# Altium project haptic_core_v2.PrjPcb (part 1 of 2)
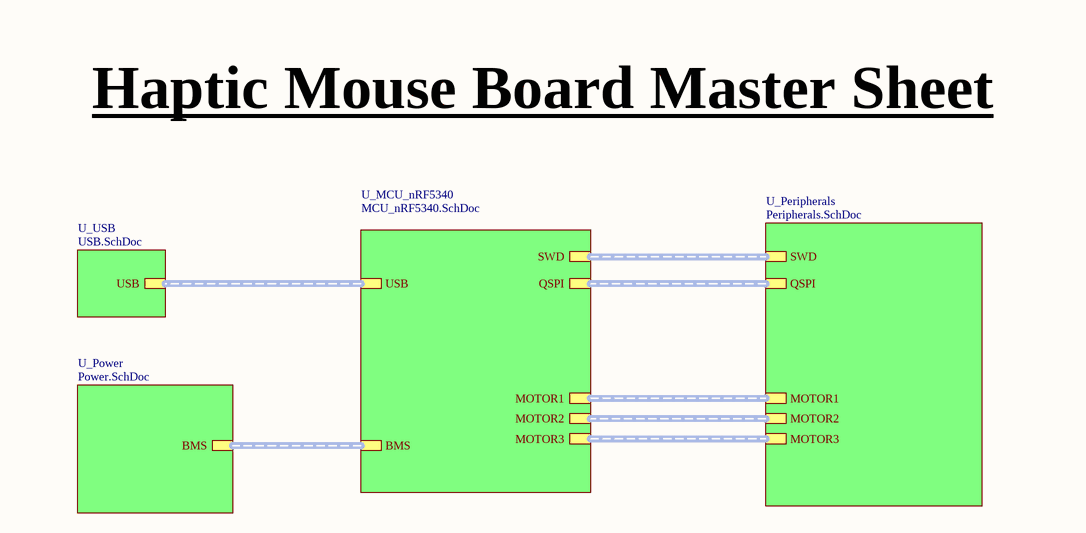
[diagram p0: MASTER.SchDoc]
5 sheets, 68 parts. Net scope: hierarchical (ports join the sheet entries above them; power ports are global).
Board file: board.PcbDoc
Sheets:
  MASTER.SchDoc
    U_Power = Power.SchDoc
    U_USB = USB.SchDoc
    U_Peripherals = Peripherals.SchDoc
    U_MCU_nRF5340 = MCU_nRF5340.SchDoc

## Sheet MASTER.SchDoc: Mouse Development Board Master Sheet
size A4; SheetNumber: 1; SheetTotal: 5; ENG_APP_DATE: --/--/--; DSN_APP_DATE: --/--/--; CHK_APP_DATE: --/--/--

### Sub-sheets
U_MCU_nRF5340 = MCU_nRF5340.SchDoc: SWD (harness STLINK), USB (harness USB), QSPI (harness QSPI), BMS (harness BMS), MOTOR1 (harness MOTOR), MOTOR2 (harness MOTOR), MOTOR3 (harness MOTOR)
U_Peripherals = Peripherals.SchDoc: SWD (harness STLINK), QSPI (harness QSPI), MOTOR1 (harness MOTOR), MOTOR2 (harness MOTOR), MOTOR3 (harness MOTOR)
U_Power = Power.SchDoc: BMS (harness BMS)
U_USB = USB.SchDoc: USB (harness USB)

### Buses and harness runs
harness sheet U_MCU_nRF5340/BMS = sheet U_Power/BMS
harness sheet U_MCU_nRF5340/MOTOR1 = sheet U_Peripherals/MOTOR1
harness sheet U_MCU_nRF5340/MOTOR2 = sheet U_Peripherals/MOTOR2
harness sheet U_MCU_nRF5340/MOTOR3 = sheet U_Peripherals/MOTOR3
harness sheet U_MCU_nRF5340/QSPI = sheet U_Peripherals/QSPI
harness sheet U_MCU_nRF5340/SWD = sheet U_Peripherals/SWD
harness sheet U_MCU_nRF5340/USB = sheet U_USB/USB

### Notes on the sheet
- Haptic Mouse Board Master Sheet
- DWG. NO.
- REV.
- SHT.
- THIS DOCUMENT AND THE DATA DISCLOSED HEREIN OR HEREWITH IS THE PROPERTY OF ALTIUM LIMITED AND MAY BE FREELY DISTRIBUTED IN WHOLE. NO RIGHTS ARE RESERVED OR EXPRESS OR IMPLIED WARANTEE GIVEN.
- REVISION
- DESCRIPTION
- DATE
- APPROVED
- ENG:
- APPROVALS
- PROJECT
- DSN:
- CHK:
- REFERENCE DOCUMENTS
- PROJECT REVISION:
- TITLE
- DOCUMENT REVISION:
- DESIGN ITEM:
- BOM:
- FAB DWG:
- PCB DWG:
- ASSY DWG:
- SCALE:
- SIZE
- B
- CAGE CODE
- FILE NAME
- DWG NO.
- SHEET
- OF
- REV

## Sheet Power.SchDoc: Power Supplies, Battery Charger & Switch
size A2; Revision: 1.0; SheetNumber: 4; SheetTotal: 5; ENG_APP_DATE: --/--/--; DSN_APP_DATE: --/--/--; CHK_APP_DATE: --/--/--
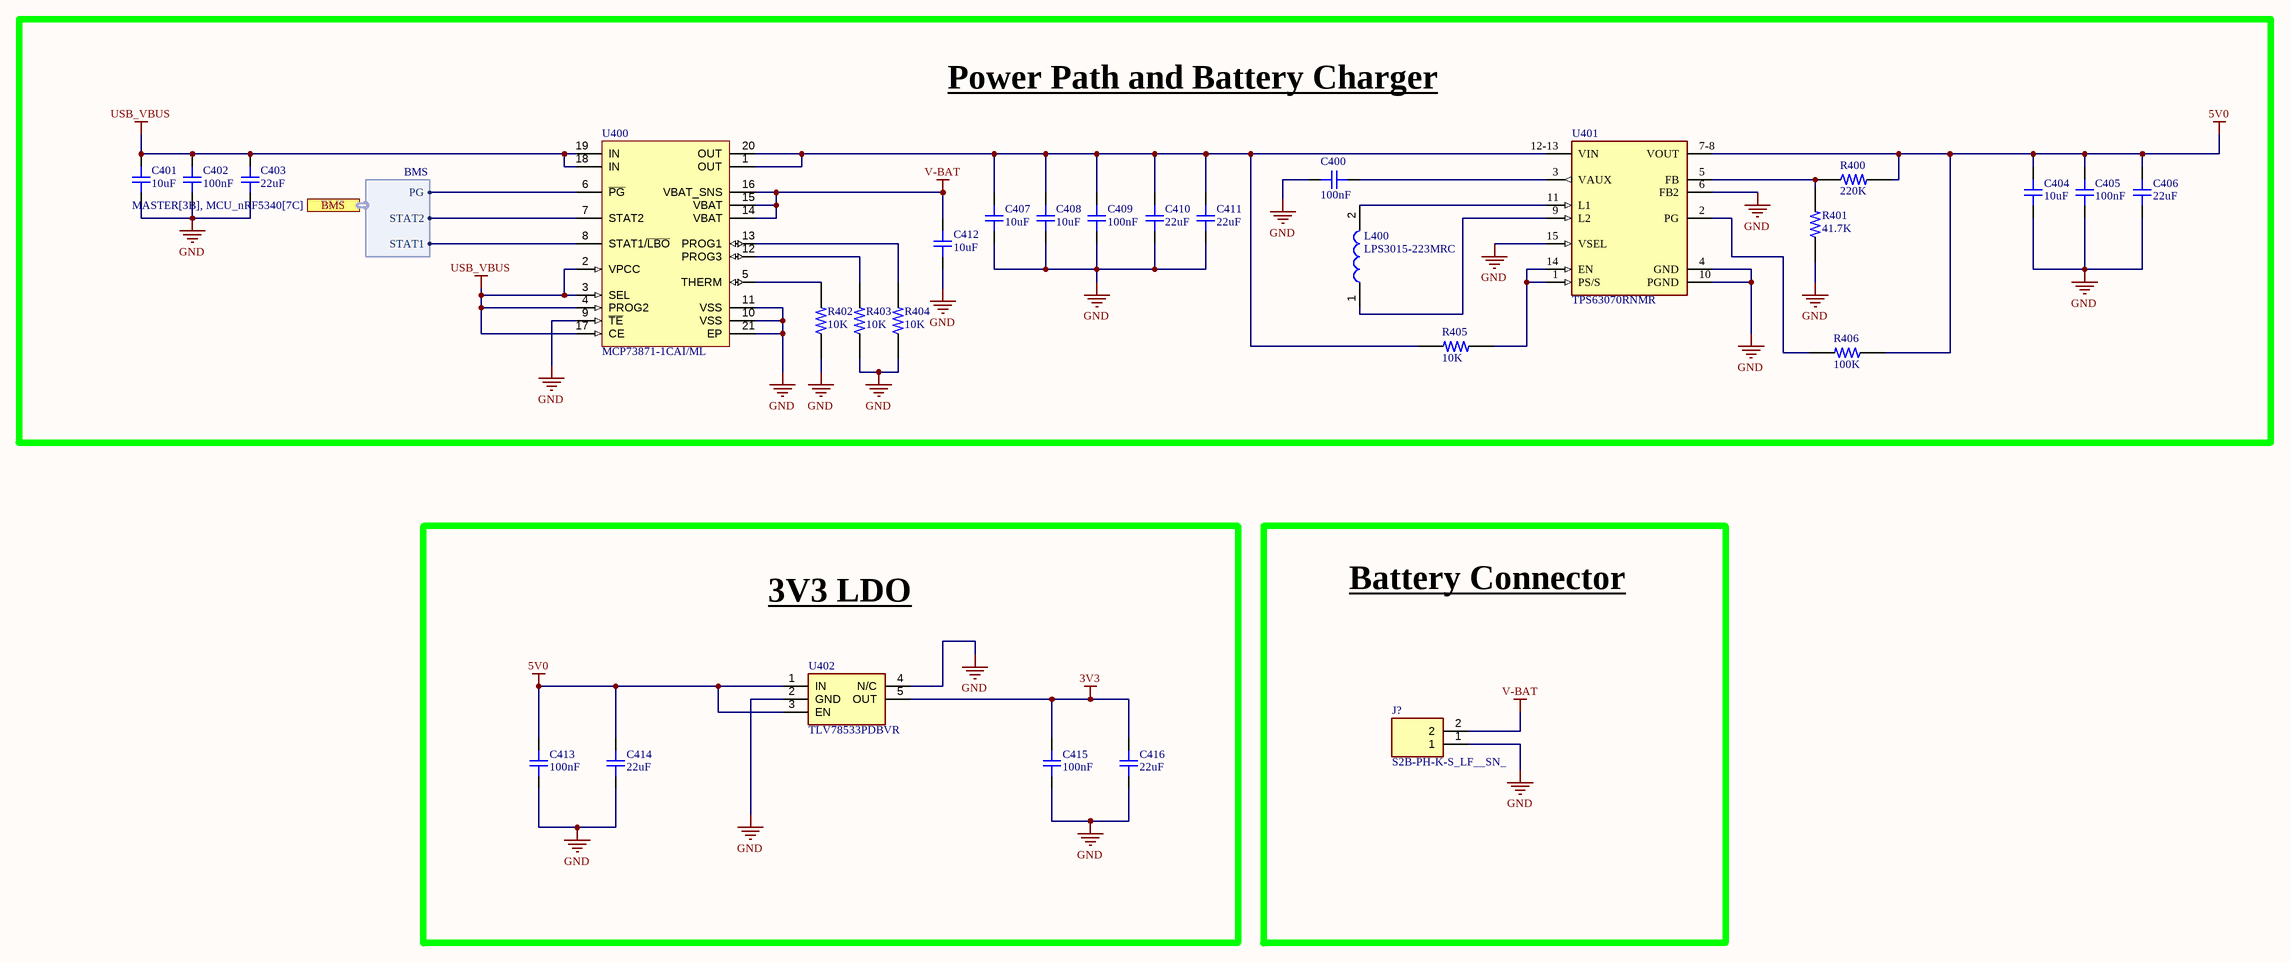
[diagram p1: Power.SchDoc]

### Parts
C400  100nF  [CAP_0603]
C401  10uF  [CAP_0603]
C402  100nF  [CAP_0603]
C403  22uF  [CAP_0603]
C404  10uF  [CAP_0603]
C405  100nF  [CAP_0603]
C406  22uF  [CAP_0603]
C407  10uF  [CAP_0603]
C408  10uF  [CAP_0603]
C409  100nF  [CAP_0603]
C410  22uF  [CAP_0603]
C411  22uF  [CAP_0603]
C412  10uF  [CAP_0603]
C413  100nF  [CAP_0603]
C414  22uF  [CAP_0603]
C415  100nF  [CAP_0603]
C416  22uF  [CAP_0603]
J?  S2B-PH-K-S_LF__SN_  [SHDRRA2W50P0X200_1X2_590X760X480P]
L400  LPS3015-223MRC  [FP-LPS3015-MFG]
R400  220K  [RESC1607X60N]
R401  41.7K  [RESC1607X60N]
R402  10K  [RESC1607X60N]
R403  10K  [RESC1607X60N]
R404  10K  [RESC1607X60N]
R405  10K  [RESC1607X60N]
R406  100K  [RESC1607X60N]
U400  MCP73871-1CAI/ML  [QFN-ML20_M]
U401  TPS63070RNMR  [FP-RNM0015A-MFG]
U402  TLV78533PDBVR  [SOT-23-5]

### Blocks framed on the sheet
Power Path and Battery Charger: C400-C412 L400 R400-R406 U400 U401
3V3 LDO: C413-C416 U402
Battery Connector: J?

### Ports
BMS (harness BMS, see MASTER[3B], MCU_nRF5340[7C])

### Harnesses
BMS: PG, STAT1, STAT2

### Nets
3V3: C415.2 C416.2 U402.5(OUT)  [project net MCU_VDD]
5V0: C404.2 C405.2 C406.2 C413.2 C414.2 R400.2 R406.1 U401.7-8(VOUT) U402.1(IN) U402.3(EN)
GND: C400.2 C401.1 C402.1 C403.1 C404.1 C405.1 C406.1 C407.1 C408.1 C409.1 C410.1 C411.1 C412.1 C413.1 C414.1 C415.1 C416.1 J?.1 R401.1 R402.1 R403.1 R404.1 U400.9(~{TE}) U400.10(VSS) U400.11(VSS) U400.21(EP) U401.4(GND) U401.6(FB2) U401.10(PGND) U401.15(VSEL) U402.2(GND) U402.4(N/C)  [project net MCU_GND]
USB_VBUS: C401.2 C402.2 C403.2 U400.2(VPCC) U400.3(SEL) U400.4(PROG2) U400.17(CE) U400.18(IN) U400.19(IN)  [project net MCU_VBUS]
V-BAT: C412.2 J?.2 U400.14(VBAT) U400.15(VBAT) U400.16(VBAT_SNS)
BMS_PG: U400.6(~{PG}) ; port BMS.PG
BMS_STAT1: U400.8(STAT1/~{LBO}) ; port BMS.STAT1
BMS_STAT2: U400.7(STAT2) ; port BMS.STAT2
NetC400_1: C400.1 U401.3(VAUX)
NetC407_2: C407.2 C408.2 C409.2 C410.2 C411.2 R405.2 U400.1(OUT) U400.20(OUT) U401.12-13(VIN)
NetL400_1: L400.1 U401.9(L2)
NetL400_2: L400.2 U401.11(L1)
NetR400_1: R400.1 R401.2 U401.5(FB)
NetR402_2: R402.2 U400.5(THERM)
NetR403_2: R403.2 U400.12(PROG3)
NetR404_2: R404.2 U400.13(PROG1)
NetR405_1: R405.1 U401.1(PS/S) U401.14(EN)
NetR406_2: R406.2 U401.2(PG)

### Notes on the sheet
- DWG. NO.
- REV.
- SHT.
- THIS DOCUMENT AND THE DATA DISCLOSED HEREIN OR HEREWITH IS THE PROPERTY OF ALTIUM LIMITED AND MAY BE FREELY DISTRIBUTED IN WHOLE. NO RIGHTS ARE RESERVED OR EXPRESS OR IMPLIED WARANTEE GIVEN.
- REVISION
- DESCRIPTION
- DATE
- APPROVED
- ENG:
- APPROVALS
- PROJECT
- DSN:
- CHK:
- REFERENCE DOCUMENTS
- PROJECT REVISION:
- TITLE
- DOCUMENT REVISION:
- DESIGN ITEM:
- BOM:
- FAB DWG:
- PCB DWG:
- ASSY DWG:
- SCALE:
- SIZE
- B
- CAGE CODE
- FILE NAME
- DWG NO.
- SHEET
- OF
- REV

### Library data of the parts
C400 C402 C405 C409 C413 C415 = CAP_0603: Multilayer Ceramic Capacitors MLCC, 0.1 uF, 10 %, 0603, 50V, X7R, TR; Manufacturer: *; Manufacturer Part Number: *; Distributor Link: *; LCSC: *; Rating: *; Dielectric: *; Supplier: Future Electronics; Supplier Part Number: 2183445; RoHS: Compliant; Category: Ceramic Capacitors; Stock: 3000; Pricing: 3000=0.0115, 9000=0.0112, 30000=0.0109, 60000=0.0108, 120000=0.0105 (USD); Value: 100nF; Dielectric Material: Ceramic; Lifecycle Status: Production; Max Operating Temperature: 125°C; Min Operating Temperature: -55°C; Mounting Technology: Surface Mount; Number of Terminals: 2; REACH SVHC: Yes; Voltage Rating (DC): 50V; ComponentLink1URL: https://datasheet.octopart.com:443/MAJCU168BB7104KTEA01-Taiyo-Yuden-datasheet-182113548.pdf?src-supplier=IHS; ComponentLink1Description: https://datasheet.octopart.com:443/MAJCU168BB7104KTEA01-Taiyo-Yuden-datasheet-182113548.pdf?src-supplier=IHS
C401 C404 C407 C408 C412 = CAP_0603: Ceramic Capacitor, Multilayer, Ceramic, 4V, 20% +Tol, 20% -Tol, X6S, 22% TC, 10uF, Surface Mount, 1608M/0603; Value: 10µF; Manufacturer: *; Manufacturer Part Number: *; Distributor Link: *; LCSC: *; Rating: *; Dielectric: *; Supplier: Mouser; Supplier Part Number: 81-GXT188C80G106ME3D; RoHS: Compliant; Category: Ceramic Capacitors; Stock: 3027; Pricing: 1=0.31, 10=0.202, 50=0.202, 100=0.115, 1000=0.082, 10000=0.063 (USD); Case/Package: 0603; Dielectric Material: Ceramic; Height: 800µm; Length: 1.6mm; Lifecycle Status: Production; Material: Ceramic; Max Operating Temperature: 105°C; Min Operating Temperature: -55°C; Mounting Technology: Surface Mount; Number of Terminals: 2; REACH SVHC: Yes; Tolerance: 20%; Voltage Rating: 4V; Voltage Rating (DC): 4V; Width: 800µm; ComponentLink1URL: http://sigma.octopart.com:80/reach_statement/Murata-company-16.pdf?src-supplier=Compliance+Statements; ComponentLink1Description: http://sigma.octopart.com:80/reach_statement/Murata-company-16.pdf?src-supplier=Compliance+Statements
C403 C406 C410 C411 C414 C416 = CAP_0603: Ceramic Capacitor, Multilayer, Ceramic, 6.3V, 20% +Tol, 20% -Tol, X6S, 22uF, Surface Mount, 1608M/0603; Value: 22µF; Manufacturer: *; Manufacturer Part Number: *; Distributor Link: *; LCSC: *; Rating: *; Dielectric: *; Supplier: Mouser; Supplier Part Number: 81-GRM188C80J226ME1D; RoHS: Compliant; Category: Ceramic Capacitors; Stock: 5675; Pricing: 1=0.3, 1=0.258, 10=0.195, 10=0.168, 50=0.195, 100=0.112, 100=0.096, 500=0.077, 1000=0.082, 1000=0.071, 2000=0.065, 4000=0.057, 8000=0.053, 10000=0.062, 24000=0.052 (USD); Case/Package: 0603; Dielectric Material: Ceramic; Height: 800µm; Length: 1.6mm; Lifecycle Status: Production; Material: Ceramic; Max Operating Temperature: 105°C; Min Operating Temperature: -55°C; Mounting Technology: Surface Mount; Number of Terminals: 2; REACH SVHC: Yes; Thickness: 800µm; Tolerance: 20%; Voltage Rating: 6.3V; Voltage Rating (DC): 6.3V; Width: 800µm; ComponentLink1URL: https://datasheet.octopart.com:443/GRM188C80J226ME01D-Murata-datasheet-165579666.pdf?src-supplier=TME; ComponentLink1Description: https://datasheet.octopart.com:443/GRM188C80J226ME01D-Murata-datasheet-165579666.pdf?src-supplier=TME; ComponentLink2URL: https://datasheet.octopart.com/GRM188C80J226ME01D-Murata-datasheet-12515295.pdf; ComponentLink2Description: https://datasheet.octopart.com/GRM188C80J226ME01D-Murata-datasheet-12515295.pdf; ComponentLink3URL: https://datasheet.octopart.com/GRM188C80J226ME01D-Murata-datasheet-12510076.pdf; ComponentLink3Description: https://datasheet.octopart.com/GRM188C80J226ME01D-Murata-datasheet-12510076.pdf; ComponentLink4URL: https://datasheet.octopart.com/GRM188C80J226ME01D-Murata-datasheet-11978611.pdf; ComponentLink4Description: https://datasheet.octopart.com/GRM188C80J226ME01D-Murata-datasheet-11978611.pdf; ComponentLink5URL: https://datasheet.octopart.com/GRM188C80J226ME01D-Murata-datasheet-10025737.pdf; ComponentLink5Description: https://datasheet.octopart.com/GRM188C80J226ME01D-Murata-datasheet-10025737.pdf; ComponentLink6URL: https://datasheet.octopart.com/GRM188C80J226ME01D-Murata-datasheet-8819587.pdf; ComponentLink6Description: https://datasheet.octopart.com/GRM188C80J226ME01D-Murata-datasheet-8819587.pdf; ComponentLink7URL: http://sigma.octopart.com:80/reach_statement/Murata-company-16.pdf?src-supplier=Compliance+Statements; ComponentLink7Description: http://sigma.octopart.com:80/reach_statement/Murata-company-16.pdf?src-supplier=Compliance+Statements
J? = S2B-PH-K-S_LF__SN_: PH-2.0mm Header side entry 2 way JST PH Series, Series Number S2B, 2mm Pitch 2 Way 1 Row Right Angle PCB Header, Through Hole Termination, 2A; Manufacturer_Name: JST (JAPAN SOLDERLESS TERMINALS); Manufacturer_Part_Number: S2B-PH-K-S(LF)(SN); Geometry.Height: 4.8mm; Mouser Part Number: 306-S2BPHKSLFSNPP; Mouser Price/Stock: https://www.mouser.co.uk/ProductDetail/JST-Commercial/S2B-PH-K-SLFSN?qs=cdbOS8ANM9A5Ie4gXeMjTA%3D%3D; Datasheet Link: *
L400 = LPS3015-223MRC: Inductor; Manufacturer_Name: COILCRAFT; Datasheet Link: https://www.digikey.com/en/products/detail/coilcraft/LPS3015-223MRC/12714657; Height: 1.5mm; Manufacturer_Part_Number: LPS3015-223MRC; Mouser Part Number: 994-LPS3015-223MRC; Mouser Price/Stock: https://www.mouser.co.uk/ProductDetail/Coilcraft/LPS3015-223MRC?qs=QQJxVsr8EGYLL9xIR9QoZA%3D%3D
R400 = RC0603JR0710KL: Res Thick Film 0603 220K Ohm 1% 1/10W ±100ppm/°C Molded SMD SMD Paper Tape on Plastic Reel; Manufacturer: Bourns; Manufacturer Part Number: CR0603-FX-2203ELF; MF: Yageo; Max Power Dissipation: 100mW; Voltage Rating: 75V; Voltage Rating (DC): 50V; SnapEDA_Link: https://www.snapeda.com/parts/RC0603JR0710KL/Yageo/view-part/?ref=snap; Package: 0603 Yageo; Value: *; MP: RC0603JR0710KL; Check_prices: https://www.snapeda.com/parts/RC0603JR0710KL/Yageo/view-part/?ref=eda; Supplier: RS; Supplier Part Number: 458582; RoHS: Compliant; Category: Chip SMD Resistors; Stock: 14800; Pricing: 10=0.004 (EUR); Case/Package: 0603; Case Code (Imperial): 0603; Case Code (Metric): 1608; China RoHS: Non-Compliant; Composition: Thick Film; Contact Plating: Tin; Features: Moisture Resistant; Height: 450µm; Length: 1.6002mm; Lifecycle Status: Production; Max Operating Temperature: 155°C; Min Operating Temperature: -55°C; Mounting Technology: Surface Mount; Number of Terminals: 2; Number of Terminations: 2; Power Dissipation: 100mW; Power Rating: 100mW; Radiation Hardening: No; REACH SVHC: Yes; Schedule B: 8533210045, 8533210045|8533210045, 8533210045|8533210045|8533210045, 8533210045|8533210045|8533210045|8533210045; Temperature Coefficient: 100ppm/°C; Termination: SMD/SMT; Tolerance: 1%; Width: 800µm; Working Voltage: 75V; ComponentLink1URL: https://datasheet.octopart.com:443/CR0603-FX-2203ELF-Bourns-datasheet-159578630.pdf?src-supplier=ODG+(Origin+Data+Global); ComponentLink1Description: https://datasheet.octopart.com:443/CR0603-FX-2203ELF-Bourns-datasheet-159578630.pdf?src-supplier=ODG+(Origin+Data+Global); ComponentLink2URL: https://datasheet.octopart.com:443/CR0603-FX-2203ELF-Bourns-datasheet-181955239.pdf?src-supplier=IHS; ComponentLink2Description: https://datasheet.octopart.com:443/CR0603-FX-2203ELF-Bourns-datasheet-181955239.pdf?src-supplier=IHS; ComponentLink3URL: https://datasheet.octopart.com:443/CR0603-FX-2203ELF-Bourns-datasheet-68301634.pdf?src-supplier=Burklin+Elektronik; ComponentLink3Description: https://datasheet.octopart.com:443/CR0603-FX-2203ELF-Bourns-datasheet-68301634.pdf?src-supplier=Burklin+Elektronik; ComponentLink4URL: https://datasheet.octopart.com:443/CR0603-FX-2203ELF-Bourns-datasheet-49799764.pdf?src-supplier=Newark; ComponentLink4Description: https://datasheet.octopart.com:443/CR0603-FX-2203ELF-Bourns-datasheet-49799764.pdf?src-supplier=Newark; ComponentLink5URL: https://datasheet.octopart.com:443/CR0603-FX-2203ELF-Bourns-datasheet-154729663.pdf?src-supplier=Electro+Sonic; ComponentLink5Description: https://datasheet.octopart.com:443/CR0603-FX-2203ELF-Bourns-datasheet-154729663.pdf?src-supplier=Electro+Sonic; ComponentLink6URL: https://datasheet.octopart.com/CR0603-FX-2203ELF-Bourns-datasheet-5318152.pdf; ComponentLink6Description: https://datasheet.octopart.com/CR0603-FX-2203ELF-Bourns-datasheet-5318152.pdf; ComponentLink7URL: https://datasheet.octopart.com:443/CR0603-FX-2203ELF-Bourns-datasheet-137066215.pdf?src-supplier=X-ON; ComponentLink7Description: https://datasheet.octopart.com:443/CR0603-FX-2203ELF-Bourns-datasheet-137066215.pdf?src-supplier=X-ON; ComponentLink8URL: https://datasheet.octopart.com:443/CR0603-FX-2203ELF-Bourns-datasheet-140567134.pdf?src-supplier=Arrow.cn; ComponentLink8Description: https://datasheet.octopart.com:443/CR0603-FX-2203ELF-Bourns-datasheet-140567134.pdf?src-supplier=Arrow.cn; ComponentLink9URL: http://sigma.octopart.com:80/conflict_mineral_statement/Bourns-company-36.pdf?src-supplier=Compliance+Statements; ComponentLink9Description: http://sigma.octopart.com:80/conflict_mineral_statement/Bourns-company-36.pdf?src-supplier=Compliance+Statements
R401 = RC0603JR0710KL: Res Thin Film 0402 41.7K Ohm 0.1% 1/16W 25ppm/C Molded SMD SMD Paper T/R; Manufacturer: Vishay; Manufacturer Part Number: TNPW040241K7BEED; MF: Yageo; Max Power Dissipation: 63mW; Temperature Coefficient: 25ppm/°C; Working Voltage: 50V; SnapEDA_Link: https://www.snapeda.com/parts/RC0603JR0710KL/Yageo/view-part/?ref=snap; Package: 0603 Yageo; Value: *; MP: RC0603JR0710KL; Check_prices: https://www.snapeda.com/parts/RC0603JR0710KL/Yageo/view-part/?ref=eda; Supplier: Farnell; Supplier Part Number: 3975618RL; RoHS: Compliant; Category: Chip SMD Resistors; Stock: 4910; Pricing: 100=0.15, 500=0.128, 2500=0.127, 5000=0.118, 10000=0.0988 (EUR); Case/Package: 0402; China RoHS: Compliant; Composition: Thin Film; Contact Plating: Tin; Features: Anti-Sulfur, Automotive AEC-Q200, Moisture Resistant; Height: 350µm; Length: 990.6µm; Lifecycle Status: Production; Max Operating Temperature: 125°C; Min Operating Temperature: -55°C; Mounting Technology: Surface Mount; Number of Terminals: 2; Number of Terminations: 2; Power Dissipation: 63mW; Power Rating: 63mW; REACH SVHC: Yes; Tolerance: 0.1%; Width: 500µm; ComponentLink1URL: https://datasheet.octopart.com:443/TNPW040241K7BEED-Vishay-datasheet-182188515.pdf?src-supplier=IHS; ComponentLink1Description: https://datasheet.octopart.com:443/TNPW040241K7BEED-Vishay-datasheet-182188515.pdf?src-supplier=IHS; ComponentLink2URL: https://datasheet.octopart.com:443/TNPW040241K7BEED-Vishay-Dale-datasheet-182026744.pdf?src-supplier=IHS; ComponentLink2Description: https://datasheet.octopart.com:443/TNPW040241K7BEED-Vishay-Dale-datasheet-182026744.pdf?src-supplier=IHS; ComponentLink3URL: https://datasheet.octopart.com/TNPW040241K7BEED-Vishay-datasheet-13498837.pdf; ComponentLink3Description: https://datasheet.octopart.com/TNPW040241K7BEED-Vishay-datasheet-13498837.pdf; ComponentLink4URL: https://datasheet.octopart.com/TNPW040241K7BEED-Vishay-datasheet-13414878.pdf; ComponentLink4Description: https://datasheet.octopart.com/TNPW040241K7BEED-Vishay-datasheet-13414878.pdf; ComponentLink5URL: https://datasheet.octopart.com/TNPW040241K7BEED-Vishay-datasheet-13295955.pdf; ComponentLink5Description: https://datasheet.octopart.com/TNPW040241K7BEED-Vishay-datasheet-13295955.pdf; ComponentLink6URL: https://datasheet.octopart.com/TNPW040241K7BEED-Vishay-datasheet-13196373.pdf; ComponentLink6Description: https://datasheet.octopart.com/TNPW040241K7BEED-Vishay-datasheet-13196373.pdf; ComponentLink7URL: https://datasheet.octopart.com/TNPW040241K7BEED-Vishay-datasheet-13143890.pdf; ComponentLink7Description: https://datasheet.octopart.com/TNPW040241K7BEED-Vishay-datasheet-13143890.pdf; ComponentLink8URL: https://datasheet.octopart.com/TNPW040241K7BEED-Vishay-datasheet-13081780.pdf; ComponentLink8Description: https://datasheet.octopart.com/TNPW040241K7BEED-Vishay-datasheet-13081780.pdf; ComponentLink9URL: https://datasheet.octopart.com/TNPW040241K7BEED-Vishay-datasheet-13052401.pdf; ComponentLink9Description: https://datasheet.octopart.com/TNPW040241K7BEED-Vishay-datasheet-13052401.pdf; ComponentLink10URL: https://datasheet.octopart.com/TNPW040241K7BEED-Vishay-datasheet-13034137.pdf; ComponentLink10Description: https://datasheet.octopart.com/TNPW040241K7BEED-Vishay-datasheet-13034137.pdf; ComponentLink11URL: https://datasheet.octopart.com/TNPW040241K7BEED-Vishay-datasheet-12585086.pdf; ComponentLink11Description: https://datasheet.octopart.com/TNPW040241K7BEED-Vishay-datasheet-12585086.pdf; ComponentLink12URL: https://datasheet.octopart.com/TNPW040241K7BEED-Vishay-datasheet-12543131.pdf; ComponentLink12Description: https://datasheet.octopart.com/TNPW040241K7BEED-Vishay-datasheet-12543131.pdf; ComponentLink13URL: https://datasheet.octopart.com/TNPW040241K7BEED-Vishay-datasheet-12532511.pdf; ComponentLink13Description: https://datasheet.octopart.com/TNPW040241K7BEED-Vishay-datasheet-12532511.pdf; ComponentLink14URL: https://datasheet.octopart.com/TNPW040241K7BEED-Vishay-datasheet-12519971.pdf; ComponentLink14Description: https://datasheet.octopart.com/TNPW040241K7BEED-Vishay-datasheet-12519971.pdf; ComponentLink15URL: https://datasheet.octopart.com/TNPW040241K7BEED-Vishay-datasheet-12509767.pdf; ComponentLink15Description: https://datasheet.octopart.com/TNPW040241K7BEED-Vishay-datasheet-12509767.pdf; ComponentLink16URL: https://datasheet.octopart.com/TNPW040241K7BEED-Vishay-datasheet-12365287.pdf; ComponentLink16Description: https://datasheet.octopart.com/TNPW040241K7BEED-Vishay-datasheet-12365287.pdf; ComponentLink17URL: https://datasheet.octopart.com/TNPW040241K7BEED-Vishay-datasheet-10854096.pdf; ComponentLink17Description: https://datasheet.octopart.com/TNPW040241K7BEED-Vishay-datasheet-10854096.pdf; ComponentLink18URL: https://datasheet.octopart.com/TNPW040241K7BEED-Vishay-datasheet-10678752.pdf; ComponentLink18Description: https://datasheet.octopart.com/TNPW040241K7BEED-Vishay-datasheet-10678752.pdf; ComponentLink19URL: https://datasheet.octopart.com/TNPW040241K7BEED-Vishay-datasheet-10283461.pdf; ComponentLink19Description: https://datasheet.octopart.com/TNPW040241K7BEED-Vishay-datasheet-10283461.pdf; ComponentLink20URL: https://datasheet.octopart.com/TNPW040241K7BEED-Vishay-datasheet-10185418.pdf; ComponentLink20Description: https://datasheet.octopart.com/TNPW040241K7BEED-Vishay-datasheet-10185418.pdf; ComponentLink21URL: https://datasheet.octopart.com/TNPW040241K7BEED-Vishay-datasheet-10055244.pdf; ComponentLink21Description: https://datasheet.octopart.com/TNPW040241K7BEED-Vishay-datasheet-10055244.pdf; ComponentLink22URL: http://sigma.octopart.com:80/rohs_statement/Vishay-company-15.pdf?src-supplier=Compliance+Statements; ComponentLink22Description: http://sigma.octopart.com:80/rohs_statement/Vishay-company-15.pdf?src-supplier=Compliance+Statements
R402-R405 = RC0603JR0710KL: 10 kOhms ±5% 0.1W Chip Resistor 0603 Anti-Sulfur AEC-Q200 Thick Film; Manufacturer: Vishay; Manufacturer Part Number: RCA060310K0JNEA; MF: Yageo; Max Power Dissipation: 100mW; Temperature Coefficient: 200ppm/°C; Working Voltage: 75V; SnapEDA_Link: https://www.snapeda.com/parts/RC0603JR0710KL/Yageo/view-part/?ref=snap; Package: 0603 Yageo; Value: *; MP: RC0603JR0710KL; Check_prices: https://www.snapeda.com/parts/RC0603JR0710KL/Yageo/view-part/?ref=eda; Supplier: Arrow Electronics; Supplier Part Number: RCA060310K0JNEA; RoHS: Compliant; Category: Chip SMD Resistors; Stock: 2572; Pricing: 1=0.018, 10=0.005, 25=0.005, 100=0.004, 250=0.004, 500=0.004, 1000=0.004 (USD); Case/Package: 0603; Case Code (Imperial): 0603; Case Code (Metric): 1608; China RoHS: Non-Compliant; Composition: Thick Film; Contact Plating: Tin; Features: Anti-Sulfur, Automotive AEC-Q200; Height: 450µm; Length: 1.5494mm; Lifecycle Status: Production; Max Operating Temperature: 155°C; Min Operating Temperature: -55°C; Mounting Technology: Surface Mount; Number of Terminals: 2; Number of Terminations: 2; Power Dissipation: 100mW; Radiation Hardening: No; REACH SVHC: Yes; Schedule B: 8533210045, 8533210045|8533210045|8533210045|8533210045|8533210045; Tolerance: 5%; Width: 850µm; ComponentLink1URL: https://datasheet.octopart.com:443/RCA060310K0JNEA-Vishay-datasheet-181963188.pdf?src-supplier=IHS; ComponentLink1Description: https://datasheet.octopart.com:443/RCA060310K0JNEA-Vishay-datasheet-181963188.pdf?src-supplier=IHS; ComponentLink2URL: https://datasheet.octopart.com:443/RCA060310K0JNEA-Vishay-datasheet-188933149.pdf?src-supplier=TME; ComponentLink2Description: https://datasheet.octopart.com:443/RCA060310K0JNEA-Vishay-datasheet-188933149.pdf?src-supplier=TME; ComponentLink3URL: https://datasheet.octopart.com:443/RCA060310K0JNEA-Vishay-datasheet-12588632.pdf?src-supplier=Future+Electronics; ComponentLink3Description: https://datasheet.octopart.com:443/RCA060310K0JNEA-Vishay-datasheet-12588632.pdf?src-supplier=Future+Electronics; ComponentLink4URL: https://datasheet.octopart.com:443/RCA060310K0JNEA-Vishay-datasheet-12542284.pdf?src-supplier=Future+Electronics; ComponentLink4Description: https://datasheet.octopart.com:443/RCA060310K0JNEA-Vishay-datasheet-12542284.pdf?src-supplier=Future+Electronics; ComponentLink5URL: https://datasheet.octopart.com:443/RCA060310K0JNEA-Vishay-datasheet-12535775.pdf?src-supplier=Future+Electronics; ComponentLink5Description: https://datasheet.octopart.com:443/RCA060310K0JNEA-Vishay-datasheet-12535775.pdf?src-supplier=Future+Electronics; ComponentLink6URL: https://datasheet.octopart.com:443/RCA060310K0JNEA-Vishay-datasheet-12509930.pdf?src-supplier=Future+Electronics; ComponentLink6Description: https://datasheet.octopart.com:443/RCA060310K0JNEA-Vishay-datasheet-12509930.pdf?src-supplier=Future+Electronics; ComponentLink7URL: https://datasheet.octopart.com:443/RCA060310K0JNEA-Vishay-datasheet-5392162.pdf?src-supplier=Future+Electronics; ComponentLink7Description: https://datasheet.octopart.com:443/RCA060310K0JNEA-Vishay-datasheet-5392162.pdf?src-supplier=Future+Electronics; ComponentLink8URL: http://sigma.octopart.com:80/rohs_statement/Vishay-company-15.pdf?src-supplier=Compliance+Statements; ComponentLink8Description: http://sigma.octopart.com:80/rohs_statement/Vishay-company-15.pdf?src-supplier=Compliance+Statements
R406 = RC0603JR0710KL: Resistor Chip Thick Film 100k Ohm 1% 1/10W ±100ppm/°K Molded T/R; Manufacturer: Vishay; Manufacturer Part Number: CRCW0603100KFKED; MF: Yageo; Power Dissipation: 100mW; Temperature Coefficient: 100ppm/°C; Working Voltage: 75V; SnapEDA_Link: https://www.snapeda.com/parts/RC0603JR0710KL/Yageo/view-part/?ref=snap; Package: 0603 Yageo; Value: *; MP: RC0603JR0710KL; Check_prices: https://www.snapeda.com/parts/RC0603JR0710KL/Yageo/view-part/?ref=eda; Supplier: Mouser; Supplier Part Number: 71-CRCW0603100KFKED; RoHS: Compliant; Category: Chip SMD Resistors; Stock: 39690; Pricing: 1=0.12, 10=0.033, 50=0.033, 100=0.016, 1000=0.010, 10000=0.005 (USD); Case/Package: 0603; China RoHS: Non-Compliant; Height: 450µm; Lead Free: Lead Free; Lifecycle Status: Production; Max Operating Temperature: 155°C; Min Operating Temperature: -55°C; Mounting Technology: Surface Mount; Number of Terminals: 2; Power Rating: 100mW; REACH SVHC: Yes; Tolerance: 1%; Width: 850µm; ComponentLink1URL: https://datasheet.octopart.com:443/CRCW0603100KFKED-Vishay-datasheet-175423584.pdf?src-supplier=IHS; ComponentLink1Description: https://datasheet.octopart.com:443/CRCW0603100KFKED-Vishay-datasheet-175423584.pdf?src-supplier=IHS; ComponentLink2URL: http://sigma.octopart.com:80/rohs_statement/Vishay-company-15.pdf?src-supplier=Compliance+Statements; ComponentLink2Description: http://sigma.octopart.com:80/rohs_statement/Vishay-company-15.pdf?src-supplier=Compliance+Statements
U400 = MCP73871-1CAI/ML: EAR99 MCP73871 Matte Tin (Sn) Tube battery charger 5.35V 1.1A 0.5mm -40C~85C TA; Manufacturer: Microchip; Output Voltage: 4.1V; DatasheetVersion: revB, May-2009; PackageReference: QFN-ML20; PackageDescription: 20-Lead Plastic Quad Flat, No Lead Package (ML) - 4x4x0.9 mm Body [QFN]; PackageVersion: revBB, Aug-2009; Supplier: DigiKey; Supplier Part Number: MCP73871-1CAI/ML-ND; Manufacturer Part Number: MCP73871-1CAI/ML; Category: Battery Management; Stock: 47; Pricing: 1=2.08, 25=1.736 (EUR); Projected EOL Date: 2034-07-17; Case/Package: QFN; Country of Assembly: Malaysia, Thailand; Country of Fabrication: United States of America; Country of Origin: Malaysia, Thailand; Export Control Classification Number (ECCN) Code: EAR99; Harmonized Tariff Schedule (HTS) Code: 8542.39.0060; Introduction Date: 2008-07-17; Lifecycle Status: Production; Pins: 20; RoHS: Non-Compliant; ComponentLink1URL: https://datasheet.octopart.com/MCP73871-1CAI/ML-Microchip-datasheet-11053087.pdf; ComponentLink1Description: https://datasheet.octopart.com/MCP73871-1CAI/ML-Microchip-datasheet-11053087.pdf; ComponentLink2URL: https://datasheet.octopart.com:443/MCP73871-1CAI-ML-Microchip-datasheet-175858736.pdf?src-supplier=Microchip; ComponentLink2Description: https://datasheet.octopart.com:443/MCP73871-1CAI-ML-Microchip-datasheet-175858736.pdf?src-supplier=Microchip; ComponentLink3URL: https://datasheet.octopart.com:443/MCP73871-1CAI-ML-Microchip-datasheet-137252038.pdf?src-supplier=Electro+Sonic; ComponentLink3Description: https://datasheet.octopart.com:443/MCP73871-1CAI-ML-Microchip-datasheet-137252038.pdf?src-supplier=Electro+Sonic; ComponentLink4URL: https://datasheet.octopart.com:443/MCP73871-1CAI-ML-Microchip-datasheet-159005942.pdf?src-supplier=SHENGYU+ELECTRONICS; ComponentLink4Description: https://datasheet.octopart.com:443/MCP73871-1CAI-ML-Microchip-datasheet-159005942.pdf?src-supplier=SHENGYU+ELECTRONICS; ComponentLink5URL: https://datasheet.octopart.com:443/MCP73871-1CAI-ML-Microchip-datasheet-142675560.pdf?src-supplier=TME; ComponentLink5Description: https://datasheet.octopart.com:443/MCP73871-1CAI-ML-Microchip-datasheet-142675560.pdf?src-supplier=TME; ComponentLink6URL: https://datasheet.octopart.com:443/MCP73871-1CAI-ML-Microchip-datasheet-24910595.pdf?src-supplier=TME; ComponentLink6Description: https://datasheet.octopart.com:443/MCP73871-1CAI-ML-Microchip-datasheet-24910595.pdf?src-supplier=TME; ComponentLink7URL: http://sigma.octopart.com:80/188450168/materials_sheet/Microchip-MCP73871-1CAI-ML.pdf?src-supplier=Compliance+Statements; ComponentLink7Description: http://sigma.octopart.com:80/188450168/materials_sheet/Microchip-MCP73871-1CAI-ML.pdf?src-supplier=Compliance+Statements; ComponentLink8URL: http://sigma.octopart.com:80/conflict_mineral_statement/Microchip-company-68.pdf?src-supplier=Compliance+Statements; ComponentLink8Description: http://sigma.octopart.com:80/conflict_mineral_statement/Microchip-company-68.pdf?src-supplier=Compliance+Statements; ComponentLink9URL: http://sigma.octopart.com:80/conflict_mineral_statement/Microchip-company-69.pdf?src-supplier=Compliance+Statements; ComponentLink9Description: http://sigma.octopart.com:80/conflict_mineral_statement/Microchip-company-69.pdf?src-supplier=Compliance+Statements; ComponentLink10URL: http://sigma.octopart.com:80/reach_statement/Microchip-company-70.pdf?src-supplier=Compliance+Statements; ComponentLink10Description: http://sigma.octopart.com:80/reach_statement/Microchip-company-70.pdf?src-supplier=Compliance+Statements; ComponentLink11URL: http://sigma.octopart.com:80/rohs_statement/Microchip-company-71.pdf?src-supplier=Compliance+Statements; ComponentLink11Description: http://sigma.octopart.com:80/rohs_statement/Microchip-company-71.pdf?src-supplier=Compliance+Statements
U401 = TPS63070RNMR: IC REG BCK BST ADJ 3.6A 15VQFN; Manufacturer: Texas Instruments; Manufacturer Lifecycle Status: ACTIVE; Synchronous Rectifier: Yes; Output Type: Adjustable; Output Current: 2A; Max Input Voltage: 16V; Switching Frequency: 2.4MHz; Min Output Voltage: 2.5V; Output Configuration: Positive; Min Input Voltage: 2V; Topology: Buck-Boost; Number of Outputs: 1; Max Output Voltage: 9V; Quiescent Current: 50uA; Max Duty Cycle: 100%; Max Junction Temperature (Tj): 125°C; Max Operating Temperature: 125°C; Case/Package: VQFN; Number of Pins: 15; RoHS Compliant: Yes; Mount: Surface Mount; Min Operating Temperature: -40°C; Lead Free: Lead Free; Packaging: Tape and Reel; Supplier: Arrow Electronics; Supplier Part Number: TPS63070RNMR; Manufacturer Part Number: TPS63070RNMR; RoHS: Compliant; Category: Voltage Regulators - Switching; Stock: 1476; Pricing: 1=2.422, 10=1.968, 25=1.817, 100=1.658, 250=1.574, 500=1.518, 1000=1.403 (USD); Height: 1mm; Length: 3mm; Lifecycle Status: Production; Max Supply Voltage: 16V; Min Supply Voltage: 2V; Mounting Technology: Surface Mount; Pins: 15; Output Voltage: 2.5V; Schedule B: 8542390000, 8542390000|8542390000|8542390000|8542390000|8542390000; Thickness: 900µm; Width: 2.5mm; ComponentLink1URL: https://octopart.com:443/opatz8j6/c1?t=dhCZltYoo_UkPhesAZpvIZTz42jcjPYjzQrmXWuK15fI5KXqnKRrCL9KEBmr3IM6HD6YioQCFSPZfMXUDn0Vme1fr8oLJBsEBqmfs6yA0YjUz45d92W7eQYxzyF0vQVmkJOzV0l4D_EdjPxUZjJu4yz2Xnc4SBK04Rs7bqL42RcAKvJ0PJ9O_C_MfxyWmIK4NBcIiDYVjqBirsiLe-Hdw51UiXTXIN-O1wh9-QM-wbFH3PtY_kSaA31dqItJyAV3A_ATfrsLiODg4tBU0CxYGHeOm2X6r0KwYAL2nGtRZ9XlUYfaFH4zewqVjxAOzj2dIQPGWdHUhWeodas115gv1OIeLKNtKl-2xOwkJz88MQ1Vr-SJnmZIWTmdn1jarGObcJfwIAJ_&src-supplier=Texas+Instruments; ComponentLink1Description: https://octopart.com:443/opatz8j6/c1?t=dhCZltYoo_UkPhesAZpvIZTz42jcjPYjzQrmXWuK15fI5KXqnKRrCL9KEBmr3IM6HD6YioQCFSPZfMXUDn0Vme1fr8oLJBsEBqmfs6yA0YjUz45d92W7eQYxzyF0vQVmkJOzV0l4D_EdjPxUZjJu4yz2Xnc4SBK04Rs7bqL42RcAKvJ0PJ9O_C_MfxyWmIK4NBcIiDYVjqBirsiLe-Hdw51UiXTXIN-O1wh9-QM-wbFH3PtY_kSaA31dqItJyAV3A_ATfrsLiODg4tBU0CxYGHeOm2X6r0KwYAL2nGtRZ9XlUYfaFH4zewqVjxAOzj2dIQPGWdHUhWeodas115gv1OIeLKNtKl-2xOwkJz88MQ1Vr-SJnmZIWTmdn1jarGObcJfwIAJ_&src-supplier=Texas+Instruments; ComponentLink2URL: https://datasheet.octopart.com:443/TPS63070RNMR-Texas-Instruments-datasheet-99731598.pdf?src-supplier=Newark; ComponentLink2Description: https://datasheet.octopart.com:443/TPS63070RNMR-Texas-Instruments-datasheet-99731598.pdf?src-supplier=Newark; ComponentLink3URL: https://datasheet.octopart.com:443/TPS63070RNMR-Texas-Instruments-datasheet-159118225.pdf?src-supplier=LCSC; ComponentLink3Description: https://datasheet.octopart.com:443/TPS63070RNMR-Texas-Instruments-datasheet-159118225.pdf?src-supplier=LCSC; ComponentLink4URL: https://datasheet.octopart.com:443/TPS63070RNMR-Texas-Instruments-datasheet-140571939.pdf?src-supplier=Arrow.cn; ComponentLink4Description: https://datasheet.octopart.com:443/TPS63070RNMR-Texas-Instruments-datasheet-140571939.pdf?src-supplier=Arrow.cn; ComponentLink5URL: http://sigma.octopart.com:80/conflict_mineral_statement/Texas-Instruments-company-63.pdf?src-supplier=Compliance+Statements; ComponentLink5Description: http://sigma.octopart.com:80/conflict_mineral_statement/Texas-Instruments-company-63.pdf?src-supplier=Compliance+Statements; ComponentLink6URL: http://sigma.octopart.com:80/reach_statement/Texas-Instruments-company-64.pdf?src-supplier=Compliance+Statements; ComponentLink6Description: http://sigma.octopart.com:80/reach_statement/Texas-Instruments-company-64.pdf?src-supplier=Compliance+Statements
U402 = TLV78533PDBVR: Linear Voltage Regulator IC Positive Fixed 1 Output 500mA SOT-23-5; Manufacturer_Name: Texas Instruments; Geometry.Height: 1.45mm; Mouser Part Number: *; Mouser Price/Stock: *; Manufacturer_Part_Number: TLV78533PDBVR; Datasheet Link: https://www.ti.com/lit/ds/symlink/tlv785.pdf?ts=1763721349650&ref_url=https%253A%252F%252Fwww.ti.com%252Fproduct%252FTLV785%252Fpart-details%252FTLV78533PDBVR

## Sheet USB.SchDoc: USB Input & Protection
size A3; SheetNumber: 5; SheetTotal: 5; ENG_APP_DATE: --/--/--; DSN_APP_DATE: --/--/--; CHK_APP_DATE: --/--/--
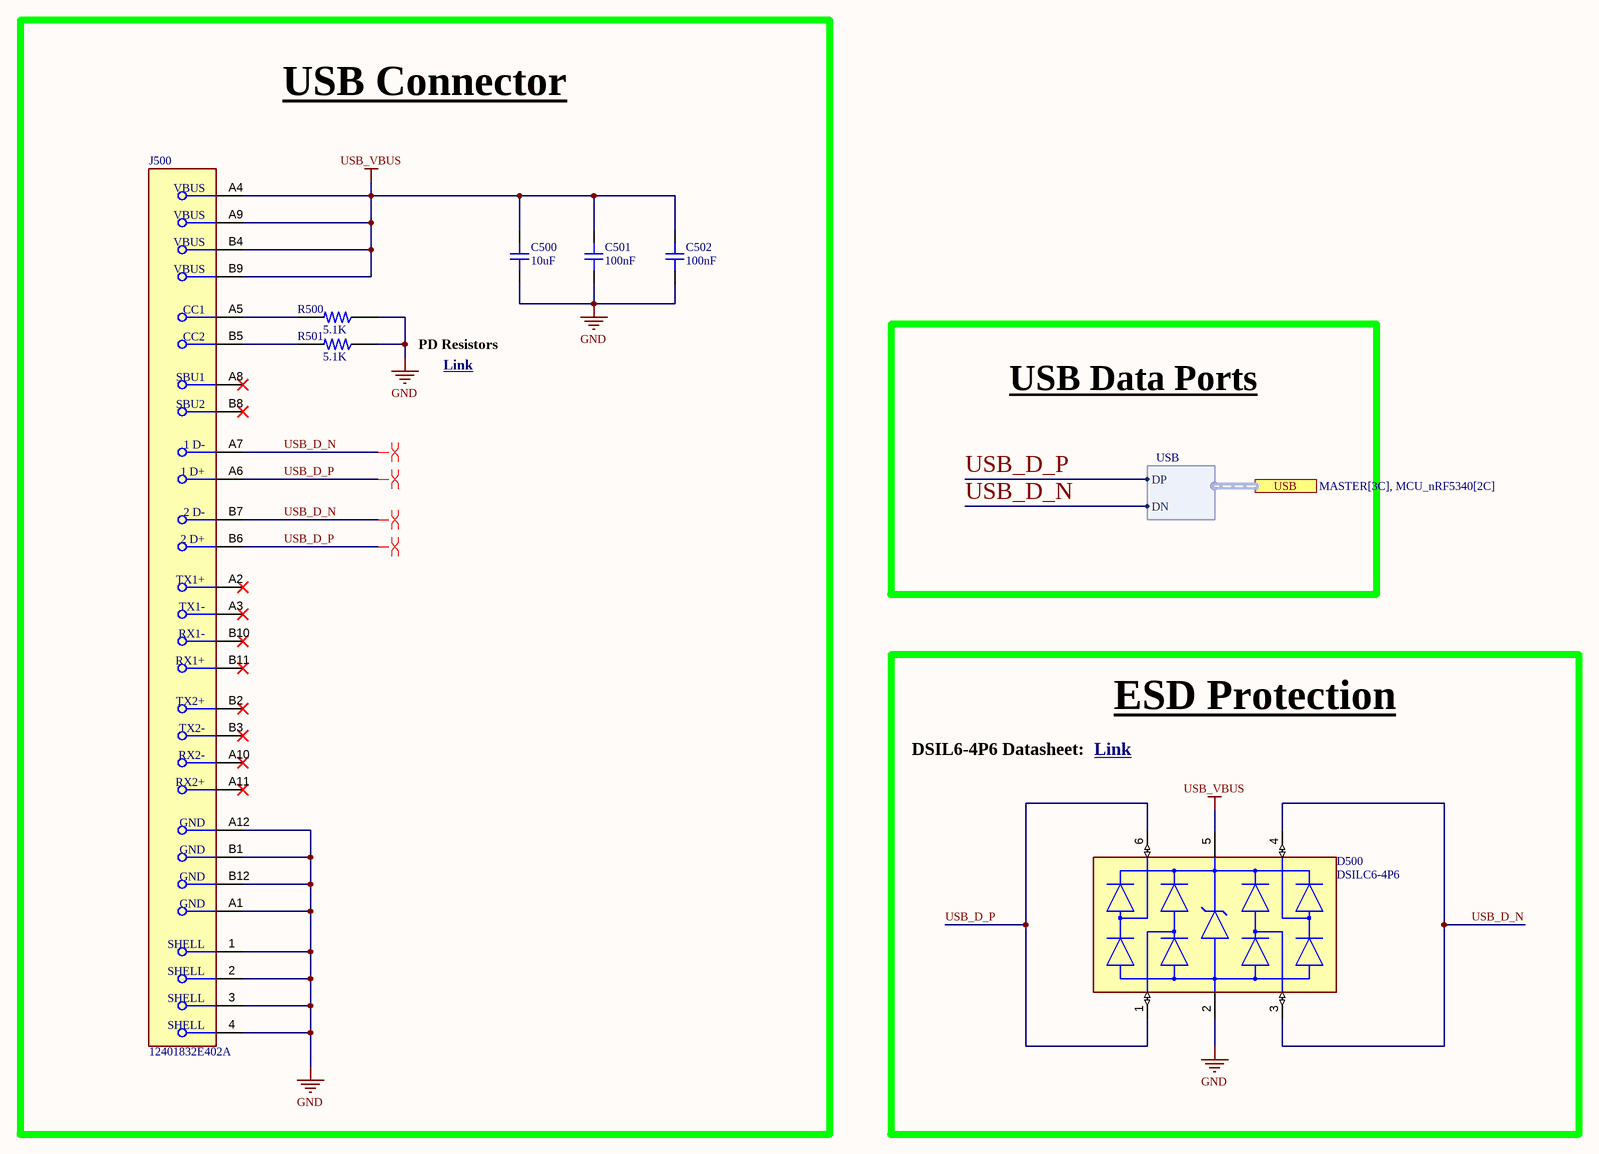
[diagram p2: USB.SchDoc]

### Parts
C500  10uF  [CAP_0603]
C501  100nF  [CAP_0603]
C502  100nF  [CAP_0603]
D500  DSILC6-4P6  [FP-SOT-666-MFG]
J500  12401832E402A  [FP-12401832E402A-MFG]
R500  5.1K  [RESC1607X60N]
R501  5.1K  [RESC1607X60N]

### Blocks framed on the sheet
USB Connector: C500-C502 J500 R500 R501
ESD Protection: D500

### Ports
USB (harness USB, see MASTER[3C], MCU_nRF5340[2C])

### Harnesses
USB: DN, DP

### Nets
GND: C500.1 C501.1 C502.1 D500.2(GND) J500.1(SHELL) J500.2(SHELL) J500.3(SHELL) J500.4(SHELL) J500.A1(GND) J500.A12(GND) J500.B1(GND) J500.B12(GND) R500.1 R501.1  [project net MCU_GND]
USB_VBUS: C500.2 C501.2 C502.2 D500.5(VCC) J500.A4(VBUS) J500.A9(VBUS) J500.B4(VBUS) J500.B9(VBUS)  [project net MCU_VBUS]
USB_D_N: D500.3(I/O2) D500.4(I/O3) J500.A7(1_D-) J500.B7(2_D-) ; port USB.DN
USB_D_P: D500.1(I/O1) D500.6(I/O4) J500.A6(1_D+) J500.B6(2_D+) ; port USB.DP
NetJ500_A5: J500.A5(CC1) R500.2
NetJ500_B5: J500.B5(CC2) R501.2

Not connected (* = marked no-connect by the designer): J500 A2(TX1+)* A3(TX1-)* A8(SBU1)* A10(RX2-)* A11(RX2+)* B2(TX2+)* B3(TX2-)* B8(SBU2)* B10(RX1-)* B11(RX1+)*

### Layout directives
differential pair: USB_D_N, USB_D_P

### Notes on the sheet
- PD Resistors
- Link <https://community.infineon.com/t5/Knowledge-Base-Articles/USB-Type-C-connector-Rp-Rd-and-Ra-termination-resistors/ta-p/253544>
- USB Data Ports
- DSIL6-4P6 Datasheet:
- Link <https://datasheet.ciiva.com/4511/cd00130230-99038-4511753.pdf?src-supplier=Mouser>
- DWG. NO.
- REV.
- SHT.
- THIS DOCUMENT AND THE DATA DISCLOSED HEREIN OR HEREWITH IS THE PROPERTY OF ALTIUM LIMITED AND MAY BE FREELY DISTRIBUTED IN WHOLE. NO RIGHTS ARE RESERVED OR EXPRESS OR IMPLIED WARANTEE GIVEN.
- REVISION
- DESCRIPTION
- DATE
- APPROVED
- ENG:
- APPROVALS
- PROJECT
- DSN:
- CHK:
- REFERENCE DOCUMENTS
- PROJECT REVISION:
- TITLE
- DOCUMENT REVISION:
- DESIGN ITEM:
- BOM:
- FAB DWG:
- PCB DWG:
- ASSY DWG:
- SCALE:
- SIZE
- B
- CAGE CODE
- FILE NAME
- DWG NO.
- SHEET
- OF
- REV

### Library data of the parts
C500-C502 = CAP_0603: Capacitor SMD 0603; Manufacturer: *; Manufacturer Part Number: *; Distributor Link: *; LCSC: *; Rating: *; Dielectric: *
D500 = CMP-12225-000033-1: TVS DIODE 5V SOT666; Manufacturer: STMicroelectronics; Number Of Channels: 4; Breakdown Voltage: 6V; Direction: Unidirectional; Peak Pulse Power: 90W; Capacitance: 1.5pF; Max Junction Temp: +125°C; Peak Pulse Current: 5A; Value: 1.5pF; Mouser Description: DSILC6 Series 4 Channel 6 V Uni-Directional Diode Array - SOT-666; Device Class L2: TVS Diodes; ComponentLink2URL: https://www.st.com/resource/en/datasheet/dsilc6-4xx.pdf; Category: Diode; Automotive: No; Lead Free: Yes; ComponentLink2Description: Datasheet; Octopart: https://octopart.com/dsilc6-4p6-stmicroelectronics-660265; Reverse Standoff Voltage: 5V; Height: 0.6mm; Package: SOT-666; Device Class L3: unset; Manufacturer Part Number: DSILC6-4P6; Temperature: to +125°C; Digikey Description: TVS DIODE 5V SOT666; Temperature Range High: +125°C; RoHS: TRUE; Device Class L1: Circuit Protection
J500 = CMP-02355-000004-1: CONN RCP USB3.1 TYPEC 24P SMD RA
R500 R501 = RC0603JR0710KL: 10 kOhms Â±5% 0.1W, 1/10W Chip Resistor 0603 (1608 Metric) Moisture Resistant Thick Film; MF: Yageo; SnapEDA_Link: https://www.snapeda.com/parts/RC0603JR0710KL/Yageo/view-part/?ref=snap; Package: 0603 Yageo; Value: *; MP: RC0603JR0710KL; Check_prices: https://www.snapeda.com/parts/RC0603JR0710KL/Yageo/view-part/?ref=eda

## Sheet Peripherals.SchDoc: Sensors & Peripherals Interfaces
size A2; SheetNumber: 3; SheetTotal: 5
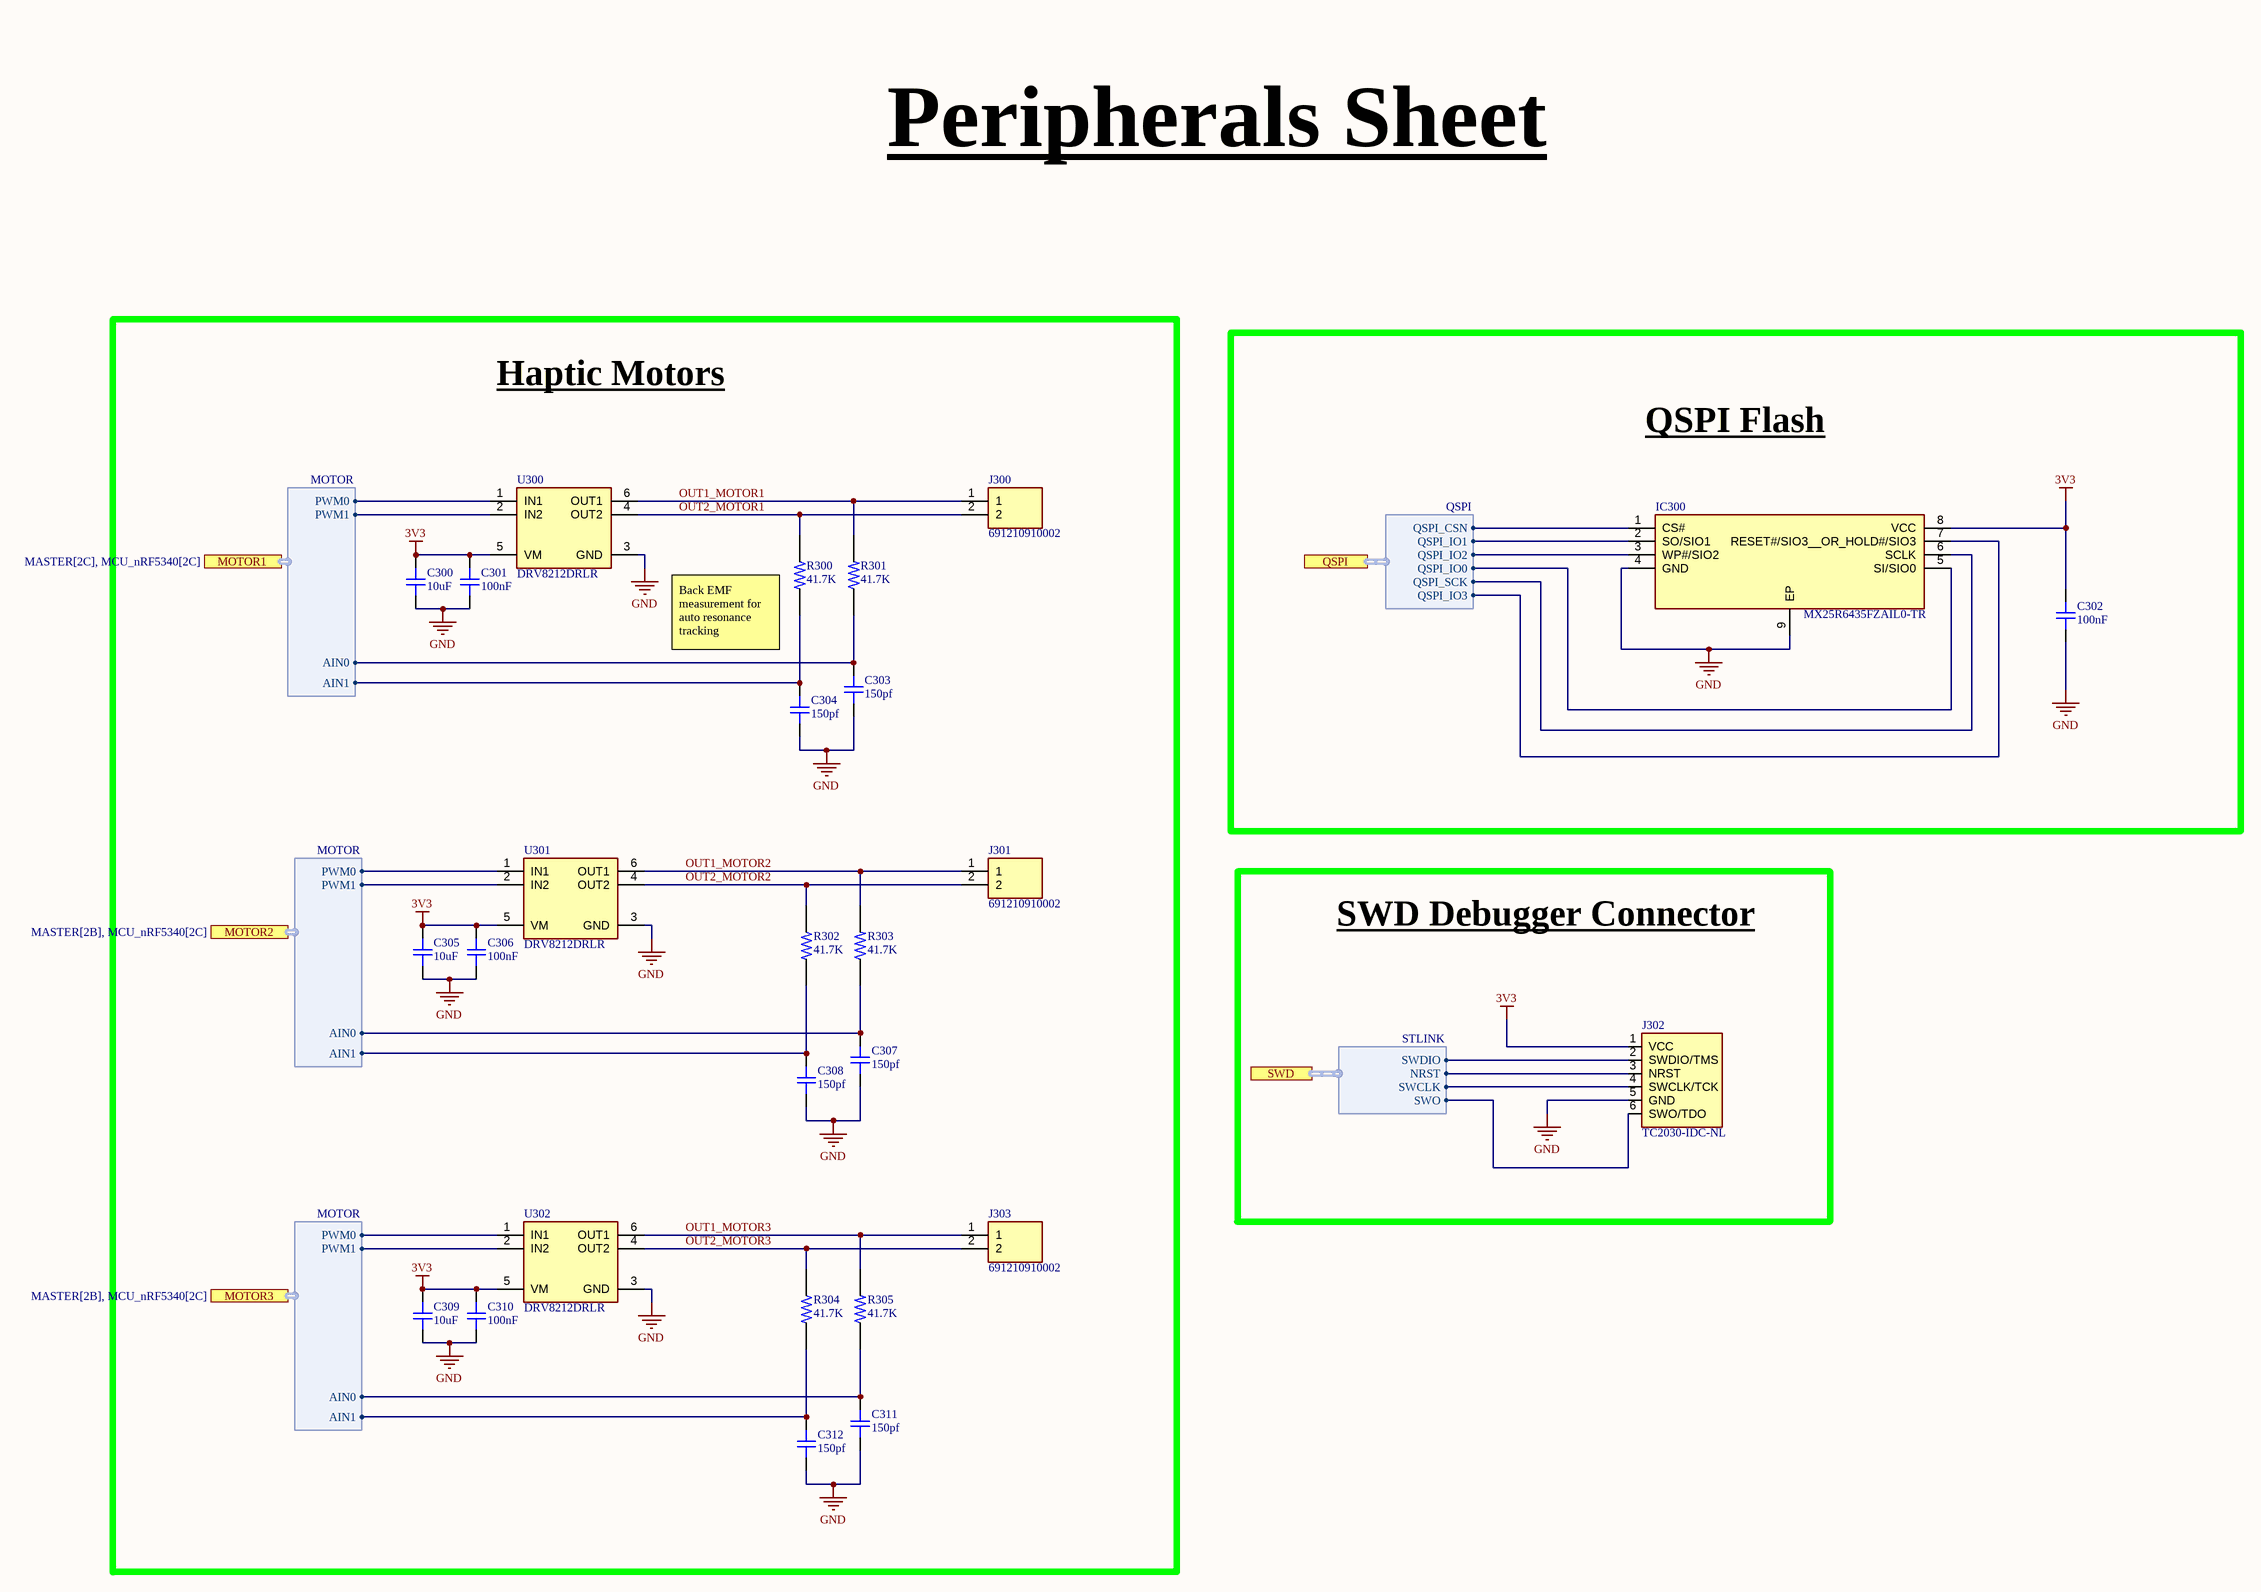
[diagram p3: Peripherals.SchDoc]

### Parts
C300  10uF  [CAP_0603]
C301  100nF  [CAP_0603]
C302  100nF  [CAP_0603]
C303  150pf  [CAP_0603]
C304  150pf  [CAP_0603]
C305  10uF  [CAP_0603]
C306  100nF  [CAP_0603]
C307  150pf  [CAP_0603]
C308  150pf  [CAP_0603]
C309  10uF  [CAP_0603]
C310  100nF  [CAP_0603]
C311  150pf  [CAP_0603]
C312  150pf  [CAP_0603]
IC300  MX25R6435FZAIL0-TR  [SON80P400X400X60-9N]
J300  691210910002  [691210910002]
J301  691210910002  [691210910002]
J302  TC2030-IDC-NL  [TC2030IDC]
J303  691210910002  [691210910002]
R300  41.7K  [RESC1607X60N]
R301  41.7K  [RESC1607X60N]
R302  41.7K  [RESC1607X60N]
R303  41.7K  [RESC1607X60N]
R304  41.7K  [RESC1607X60N]
R305  41.7K  [RESC1607X60N]
U300  DRV8212DRLR  [SOTFL50P160X60-6N]
U301  DRV8212DRLR  [SOTFL50P160X60-6N]
U302  DRV8212DRLR  [SOTFL50P160X60-6N]

### Blocks framed on the sheet
Haptic Motors: C300 C301 C303-C312 J300 J301 J303 R300-R305 U300-U302
QSPI Flash: C302 IC300
SWD Debugger Connector: J302

### Ports
MOTOR1 (harness MOTOR, see MASTER[2C], MCU_nRF5340[2C]), MOTOR2 (harness MOTOR, see MASTER[2B], MCU_nRF5340[2C]), MOTOR3 (harness MOTOR, see MASTER[2B], MCU_nRF5340[2C]), QSPI (harness QSPI), SWD (harness STLINK)

### Harnesses
STLINK: NRST, SWDIO, SWCLK, SWO
QSPI: QSPI_SCK, QSPI_IO0, QSPI_IO1, QSPI_IO2, QSPI_IO3, QSPI_CSN
MOTOR: PWM1, PWM0, AIN0, AIN1

### Nets
3V3: C300.2 C301.2 C302.2 C305.2 C306.2 C309.2 C310.2 IC300.8(VCC) J302.1(VCC) U300.5(VM) U301.5(VM) U302.5(VM)  [project net MCU_VDD]
GND: C300.1 C301.1 C302.1 C303.1 C304.1 C305.1 C306.1 C307.1 C308.1 C309.1 C310.1 C311.1 C312.1 IC300.4(GND) IC300.9(EP) J302.5(GND) U300.3(GND) U301.3(GND) U302.3(GND)  [project net MCU_GND]
AIN0_M1: C303.2 R301.1 ; port MOTOR1.AIN0
AIN0_M2: C307.2 R303.1 ; port MOTOR2.AIN0
AIN0_M3: C311.2 R305.1 ; port MOTOR3.AIN0
AIN1_M1: C304.2 R300.2 ; port MOTOR1.AIN1
AIN1_M2: C308.2 R302.2 ; port MOTOR2.AIN1
AIN1_M3: C312.2 R304.2 ; port MOTOR3.AIN1
NRST: J302.3(NRST) ; port SWD.NRST
OUT1_MOTOR1: J300.1 R301.2 U300.6(OUT1)
OUT1_MOTOR2: J301.1 R303.2 U301.6(OUT1)
OUT1_MOTOR3: J303.1 R305.2 U302.6(OUT1)
OUT2_MOTOR1: J300.2 R300.1 U300.4(OUT2)
OUT2_MOTOR2: J301.2 R302.1 U301.4(OUT2)
OUT2_MOTOR3: J303.2 R304.1 U302.4(OUT2)
PWM0_M1: U300.1(IN1) ; port MOTOR1.PWM0
PWM0_M2: U301.1(IN1) ; port MOTOR2.PWM0
PWM0_M3: U302.1(IN1) ; port MOTOR3.PWM0
PWM1_M1: U300.2(IN2) ; port MOTOR1.PWM1
PWM1_M2: U301.2(IN2) ; port MOTOR2.PWM1
PWM1_M3: U302.2(IN2) ; port MOTOR3.PWM1
QSPI_CSN: IC300.1(CS#) ; port QSPI.QSPI_CSN
QSPI_IO0: IC300.5(SI/SIO0) ; port QSPI.QSPI_IO0
QSPI_IO1: IC300.2(SO/SIO1) ; port QSPI.QSPI_IO1
QSPI_IO2: IC300.3(WP#/SIO2) ; port QSPI.QSPI_IO2
QSPI_IO3: IC300.7(RESET#/SIO3__OR_HOLD#/SIO3) ; port QSPI.QSPI_IO3
QSPI_SCK: IC300.6(SCLK) ; port QSPI.QSPI_SCK
SWCLK: J302.4(SWCLK/TCK) ; port SWD.SWCLK
SWDIO: J302.2(SWDIO/TMS) ; port SWD.SWDIO
SWO: J302.6(SWO/TDO) ; port SWD.SWO

### Notes on the sheet
- Peripherals Sheet
- (near R300) Back EMF measurement for auto resonance tracking
- DWG. NO.
- REV.
- SHT.
- REVISION
- DESCRIPTION
- DATE
- APPROVED
- THIS DOCUMENT AND THE DATA DISCLOSED HEREIN OR HEREWITH IS THE PROPERTY OF ALTIUM LIMITED AND MAY BE FREELY DISTRIBUTED IN WHOLE. NO RIGHTS ARE RESERVED OR EXPRESS OR IMPLIED WARANTEE GIVEN.
- ENG:
- DSN:
- APPROVALS
- PROJECT
- DOCUMENT REVISION:
- DESIGN ITEM:
- CHK:
- BOM:
- REFERENCE DOCUMENTS
- PROJECT REVISION:
- TITLE
- FAB DWG:
- PCB DWG:
- ASSY DWG:
- SCALE:
- SIZE
- C
- CAGE CODE
- FILE NAME
- DWG NO.
- SHEET
- OF
- REV

### Library data of the parts
C300 C303-C305 C307-C309 C311 C312 = CAP_0603: as C401 on sheet Power; Manufacturer: *; Manufacturer Part Number: *; Distributor Link: *; LCSC: *; Rating: *; Dielectric: *; Supplier: Mouser; Supplier Part Number: 81-GXT188C80G106ME3D; RoHS: Compliant; Category: Ceramic Capacitors; Stock: 3027; Pricing: 1=0.31, 10=0.202, 50=0.202, 100=0.115, 1000=0.082, 10000=0.063 (USD); Case/Package: 0603; Dielectric Material: Ceramic; Height: 800µm; Length: 1.6mm; Lifecycle Status: Production; Material: Ceramic; Max Operating Temperature: 105°C; Min Operating Temperature: -55°C; Mounting Technology: Surface Mount; Number of Terminals: 2; REACH SVHC: Yes; Tolerance: 20%; Voltage Rating: 4V; Voltage Rating (DC): 4V; Width: 800µm; ComponentLink1URL: http://sigma.octopart.com:80/reach_statement/Murata-company-16.pdf?src-supplier=Compliance+Statements; ComponentLink1Description: http://sigma.octopart.com:80/reach_statement/Murata-company-16.pdf?src-supplier=Compliance+Statements
C301 C302 C306 C310 = CAP_0603: Capacitor SMD 0603; Manufacturer: *; Manufacturer Part Number: *; Distributor Link: *; LCSC: *; Rating: *; Dielectric: *
IC300 = MX25R6435FZAIL0-TR: Integrated Circuit; Manufacturer_Name: Macronix; Datasheet Link: https://www.mouser.com/datasheet/2/819/MX25R6435F_2c_Wide_Range_2c_64Mb_2c_v1_6-3370962.pdf; Height: 0.6mm; Manufacturer_Part_Number: MX25R6435FZAIL0-TR; Mouser Part Number: 95-25R6435FZAIL0TR; Mouser Price/Stock: https://www.mouser.co.uk/ProductDetail/Macronix/MX25R6435FZAIL0-TR?qs=mELouGlnn3cK%252BXKdc9RzBg%3D%3D
J300 J301 J303 = 691210910002: WR-TBL Terminal block - Rising Cage - THT Serie 2109 - 2,54mm pitch - Monoblock THT - Green - Horizontal cable entry Rising Cage Clamp 8.5mm height - 02p; Manufacturer_Name: Wurth Elektronik; Geometry.Height: 8.8mm; Mouser Part Number: 710-691210910002; Mouser Price/Stock: https://www.mouser.co.uk/ProductDetail/Wurth-Elektronik/691210910002?qs=sPbYRqrBIVlpmUgpxfjjUA%3D%3D; Manufacturer_Part_Number: 691210910002; Datasheet Link: https://www.we-online.com/catalog/datasheet/691210910002.pdf
J302 = TC2030-IDC-NL: CABLE ADAPTER 6 POS; Value: *; MP: TC2030-IDC-NL; Availability: Unavailable; Package: None; Price: None
R300-R305 = RC0603JR0710KL: as R401 on sheet Power; SnapEDA_Link: https://www.snapeda.com/parts/RC0603JR0710KL/Yageo/view-part/?ref=snap; Package: 0603 Yageo; Value: *; MP: RC0603JR0710KL; Check_prices: https://www.snapeda.com/parts/RC0603JR0710KL/Yageo/view-part/?ref=eda; Supplier: Farnell; Supplier Part Number: 3975618RL; RoHS: Compliant; Category: Chip SMD Resistors; Stock: 4910; Pricing: 100=0.15, 500=0.128, 2500=0.127, 5000=0.118, 10000=0.0988 (EUR); Case/Package: 0402; China RoHS: Compliant; Composition: Thin Film; Contact Plating: Tin; Features: Anti-Sulfur, Automotive AEC-Q200, Moisture Resistant; Height: 350µm; Length: 990.6µm; Lifecycle Status: Production; Max Operating Temperature: 125°C; Min Operating Temperature: -55°C; Mounting Technology: Surface Mount; Number of Terminals: 2; Number of Terminations: 2; Power Dissipation: 63mW; Power Rating: 63mW; REACH SVHC: Yes; Tolerance: 0.1%; Width: 500µm; ComponentLink1URL: https://datasheet.octopart.com:443/TNPW040241K7BEED-Vishay-datasheet-182188515.pdf?src-supplier=IHS; ComponentLink1Description: https://datasheet.octopart.com:443/TNPW040241K7BEED-Vishay-datasheet-182188515.pdf?src-supplier=IHS; ComponentLink2URL: https://datasheet.octopart.com:443/TNPW040241K7BEED-Vishay-Dale-datasheet-182026744.pdf?src-supplier=IHS; ComponentLink2Description: https://datasheet.octopart.com:443/TNPW040241K7BEED-Vishay-Dale-datasheet-182026744.pdf?src-supplier=IHS; ComponentLink3URL: https://datasheet.octopart.com/TNPW040241K7BEED-Vishay-datasheet-13498837.pdf; ComponentLink3Description: https://datasheet.octopart.com/TNPW040241K7BEED-Vishay-datasheet-13498837.pdf; ComponentLink4URL: https://datasheet.octopart.com/TNPW040241K7BEED-Vishay-datasheet-13414878.pdf; ComponentLink4Description: https://datasheet.octopart.com/TNPW040241K7BEED-Vishay-datasheet-13414878.pdf; ComponentLink5URL: https://datasheet.octopart.com/TNPW040241K7BEED-Vishay-datasheet-13295955.pdf; ComponentLink5Description: https://datasheet.octopart.com/TNPW040241K7BEED-Vishay-datasheet-13295955.pdf; ComponentLink6URL: https://datasheet.octopart.com/TNPW040241K7BEED-Vishay-datasheet-13196373.pdf; ComponentLink6Description: https://datasheet.octopart.com/TNPW040241K7BEED-Vishay-datasheet-13196373.pdf; ComponentLink7URL: https://datasheet.octopart.com/TNPW040241K7BEED-Vishay-datasheet-13143890.pdf; ComponentLink7Description: https://datasheet.octopart.com/TNPW040241K7BEED-Vishay-datasheet-13143890.pdf; ComponentLink8URL: https://datasheet.octopart.com/TNPW040241K7BEED-Vishay-datasheet-13081780.pdf; ComponentLink8Description: https://datasheet.octopart.com/TNPW040241K7BEED-Vishay-datasheet-13081780.pdf; ComponentLink9URL: https://datasheet.octopart.com/TNPW040241K7BEED-Vishay-datasheet-13052401.pdf; ComponentLink9Description: https://datasheet.octopart.com/TNPW040241K7BEED-Vishay-datasheet-13052401.pdf; ComponentLink10URL: https://datasheet.octopart.com/TNPW040241K7BEED-Vishay-datasheet-13034137.pdf; ComponentLink10Description: https://datasheet.octopart.com/TNPW040241K7BEED-Vishay-datasheet-13034137.pdf; ComponentLink11URL: https://datasheet.octopart.com/TNPW040241K7BEED-Vishay-datasheet-12585086.pdf; ComponentLink11Description: https://datasheet.octopart.com/TNPW040241K7BEED-Vishay-datasheet-12585086.pdf; ComponentLink12URL: https://datasheet.octopart.com/TNPW040241K7BEED-Vishay-datasheet-12543131.pdf; ComponentLink12Description: https://datasheet.octopart.com/TNPW040241K7BEED-Vishay-datasheet-12543131.pdf; ComponentLink13URL: https://datasheet.octopart.com/TNPW040241K7BEED-Vishay-datasheet-12532511.pdf; ComponentLink13Description: https://datasheet.octopart.com/TNPW040241K7BEED-Vishay-datasheet-12532511.pdf; ComponentLink14URL: https://datasheet.octopart.com/TNPW040241K7BEED-Vishay-datasheet-12519971.pdf; ComponentLink14Description: https://datasheet.octopart.com/TNPW040241K7BEED-Vishay-datasheet-12519971.pdf; ComponentLink15URL: https://datasheet.octopart.com/TNPW040241K7BEED-Vishay-datasheet-12509767.pdf; ComponentLink15Description: https://datasheet.octopart.com/TNPW040241K7BEED-Vishay-datasheet-12509767.pdf; ComponentLink16URL: https://datasheet.octopart.com/TNPW040241K7BEED-Vishay-datasheet-12365287.pdf; ComponentLink16Description: https://datasheet.octopart.com/TNPW040241K7BEED-Vishay-datasheet-12365287.pdf; ComponentLink17URL: https://datasheet.octopart.com/TNPW040241K7BEED-Vishay-datasheet-10854096.pdf; ComponentLink17Description: https://datasheet.octopart.com/TNPW040241K7BEED-Vishay-datasheet-10854096.pdf; ComponentLink18URL: https://datasheet.octopart.com/TNPW040241K7BEED-Vishay-datasheet-10678752.pdf; ComponentLink18Description: https://datasheet.octopart.com/TNPW040241K7BEED-Vishay-datasheet-10678752.pdf; ComponentLink19URL: https://datasheet.octopart.com/TNPW040241K7BEED-Vishay-datasheet-10283461.pdf; ComponentLink19Description: https://datasheet.octopart.com/TNPW040241K7BEED-Vishay-datasheet-10283461.pdf; ComponentLink20URL: https://datasheet.octopart.com/TNPW040241K7BEED-Vishay-datasheet-10185418.pdf; ComponentLink20Description: https://datasheet.octopart.com/TNPW040241K7BEED-Vishay-datasheet-10185418.pdf; ComponentLink21URL: https://datasheet.octopart.com/TNPW040241K7BEED-Vishay-datasheet-10055244.pdf; ComponentLink21Description: https://datasheet.octopart.com/TNPW040241K7BEED-Vishay-datasheet-10055244.pdf; ComponentLink22URL: http://sigma.octopart.com:80/rohs_statement/Vishay-company-15.pdf?src-supplier=Compliance+Statements; ComponentLink22Description: http://sigma.octopart.com:80/rohs_statement/Vishay-company-15.pdf?src-supplier=Compliance+Statements
U300-U302 = DRV8212DRLR: Motor / Motion / Ignition Controllers & Drivers 12-V, 2-A Low voltage H-bridge motor driver; Manufacturer_Name: Texas Instruments; Geometry.Height: 0.6mm; Mouser Part Number: 595-DRV8212DRLR; Mouser Price/Stock: https://www.mouser.co.uk/ProductDetail/Texas-Instruments/DRV8212DRLR?qs=7D1LtPJG0i3wtDTC%2FUQdKg%3D%3D; Manufacturer_Part_Number: DRV8212DRLR; Datasheet Link: https://www.ti.com/lit/ds/symlink/drv8212.pdf?ts=1631761675954&ref_url=https%253A%252F%252Fwww.ti.com%252Fstore%252Fti%252Fen%252Fp%252Fproduct%252F%253Fp%253DDRV8212DRLR%2526keyMatch%253DDRV8212DRLR%2526tisearch%253Dsearch-everything%2526usecase%253DOPN